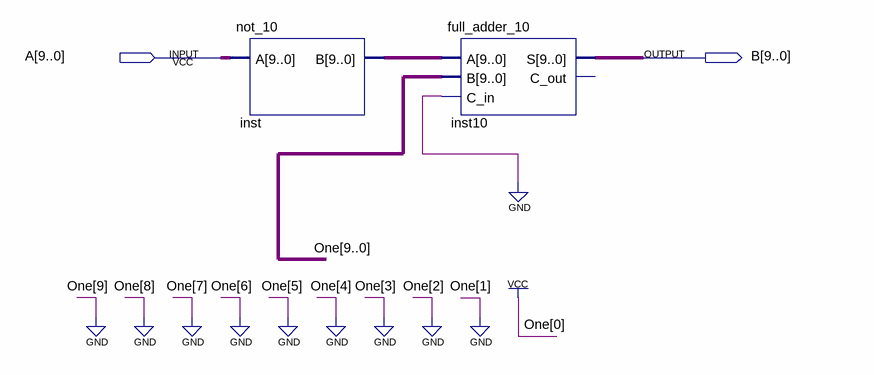
[diagram p0: schematic sheet]
// Quartus schematic twos_compl_10.bdf as structural Verilog: 2 symbols, 2 pins
module twos_compl_10 (
  input  [9:0] A,
  output [9:0] B
);

  wire [9:0] inst_b;

  not_10 inst (.A(A), .B(inst_b));
  full_adder_10 inst10 (.A(inst_b), .B(10'b0000000001), .C_in(1'b0), .S(B));  // open: C_out
endmodule
